# EAGLE design tc connecor test spacing (EAGLE 6.5.0)
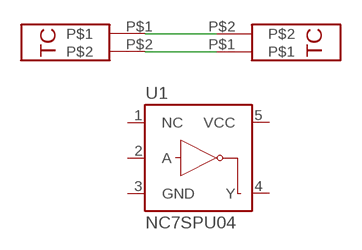
[diagram p0: schematic, sheet 1]

## Parts
U1  NC7SPU04  INVERTER_SC70-5  [SC70]
U$1  TC-MINI-INSIDE  [TC-CLIP-INSIDE]
U$2  TC-MINI-OUTSIDE  [TC-CLIP-OUTSIDE]

## Nets
N$1: U$1.P$1 U$2.P$2
N$2: U$1.P$2 U$2.P$1
Unconnected: U1.1(NC) U1.2(A) U1.3(GND) U1.4(Y) U1.5(VCC)

## Library data of the parts
U1 = SparkFun-DigitalIC:INVERTER: Single inverter, SOT23-5; PROD_ID: 8803
U$1 = PaxInstruments-Connectors:TC-MINI-INSIDE
U$2 = PaxInstruments-Connectors:TC-MINI-OUTSIDE

## Board
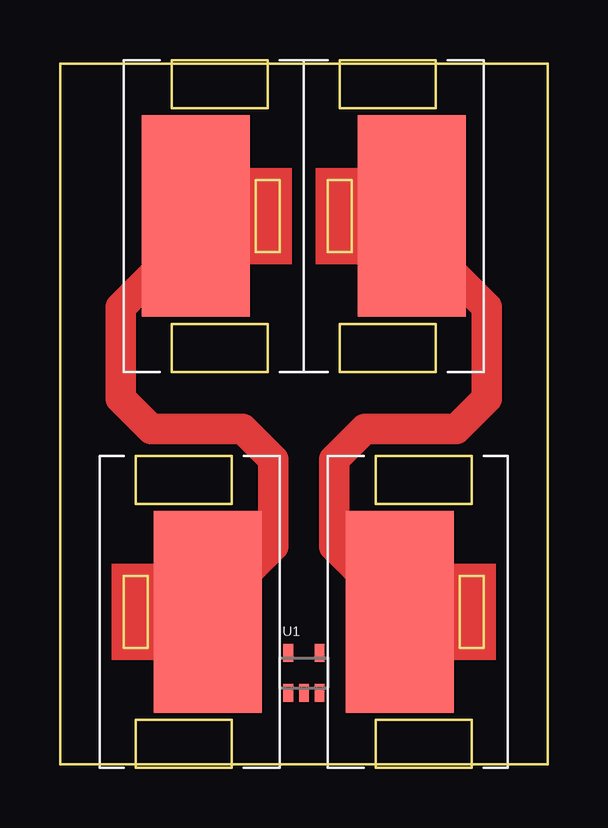
[diagram p1: board, top side]
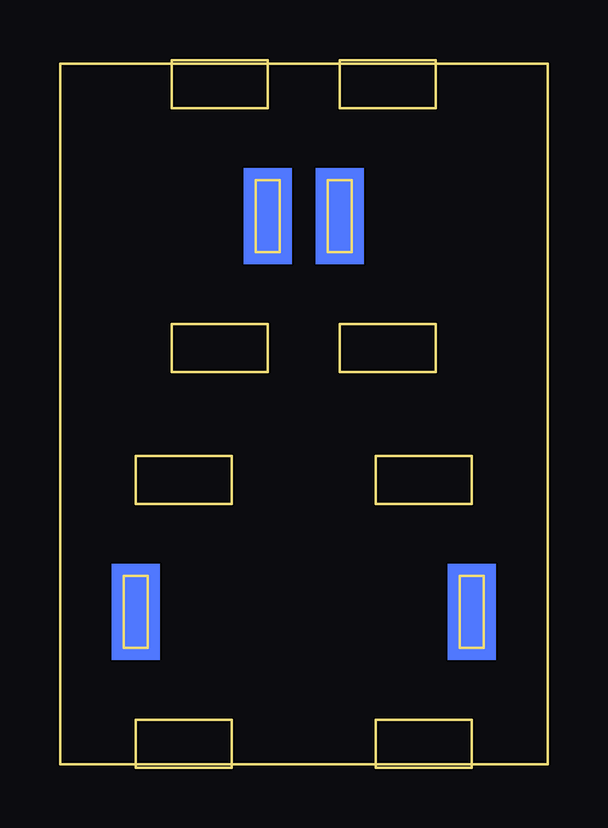
[diagram p2: board, bottom side, seen from below]

Size 20.32 x 29.21 mm. Coordinates in mm from the lower left corner, seen from the top.
Outline: 0,0 20.32,0 20.32,29.21 0,29.21 0,0
Copper layers (1*16): Top 0.035mm / dielectric 1.5mm / Bottom 0.035mm
Design rules "default": minimum track width 10mil, minimum drill 24mil, track to track 8mil, track to pad 8mil, pad to pad 8mil, via to via 8mil, smd to smd 8mil, copper to edge 40mil, drill to drill 8mil, minimum pad ring 10mil, minimum via ring 8mil, stop-mask expansion 4mil, vias tented up to drill 0mil, thermal gap 10mil

### Footprints (pad centres in the part's own frame; a part is rotated, then mirrored left to right if it is on the bottom)
SC70 = smd 0.4 x 0.75: 1 -0.65,-0.825; 2 0,-0.825; 3 0.65,-0.825; 4 0.65,0.825; 5 -0.65,0.825
TC-CLIP-INSIDE = smd 4.5 x 8.4: P$1 -4,0; P$2 4,0
TC-CLIP-OUTSIDE = smd 4.5 x 8.4: P$1 4.5,0; P$2 -4.5,0

### Placement (x,y rotation side)
U1  10.16,3.81 0 top
U$1  10.16,6.35 0 top
U$2  10.16,22.86 0 top

### Tracks (layer width: path | path; a pad name or v marks a point on that pad's centre or on a via)
N$1
  Top 1.27: U$1.P$1 8.89,9.08 8.89,12.7 7.62,13.97 3.81,13.97 2.54,15.24 2.54,19.05 5.66,22.17 U$2.P$2
N$2
  Top 1.27: U$1.P$2 11.43,9.08 11.43,12.7 12.7,13.97 16.51,13.97 17.78,15.24 17.78,19.05 14.66,22.17 U$2.P$1